# EAGLE design E-P-204-R3.2 (EAGLE 6.4)
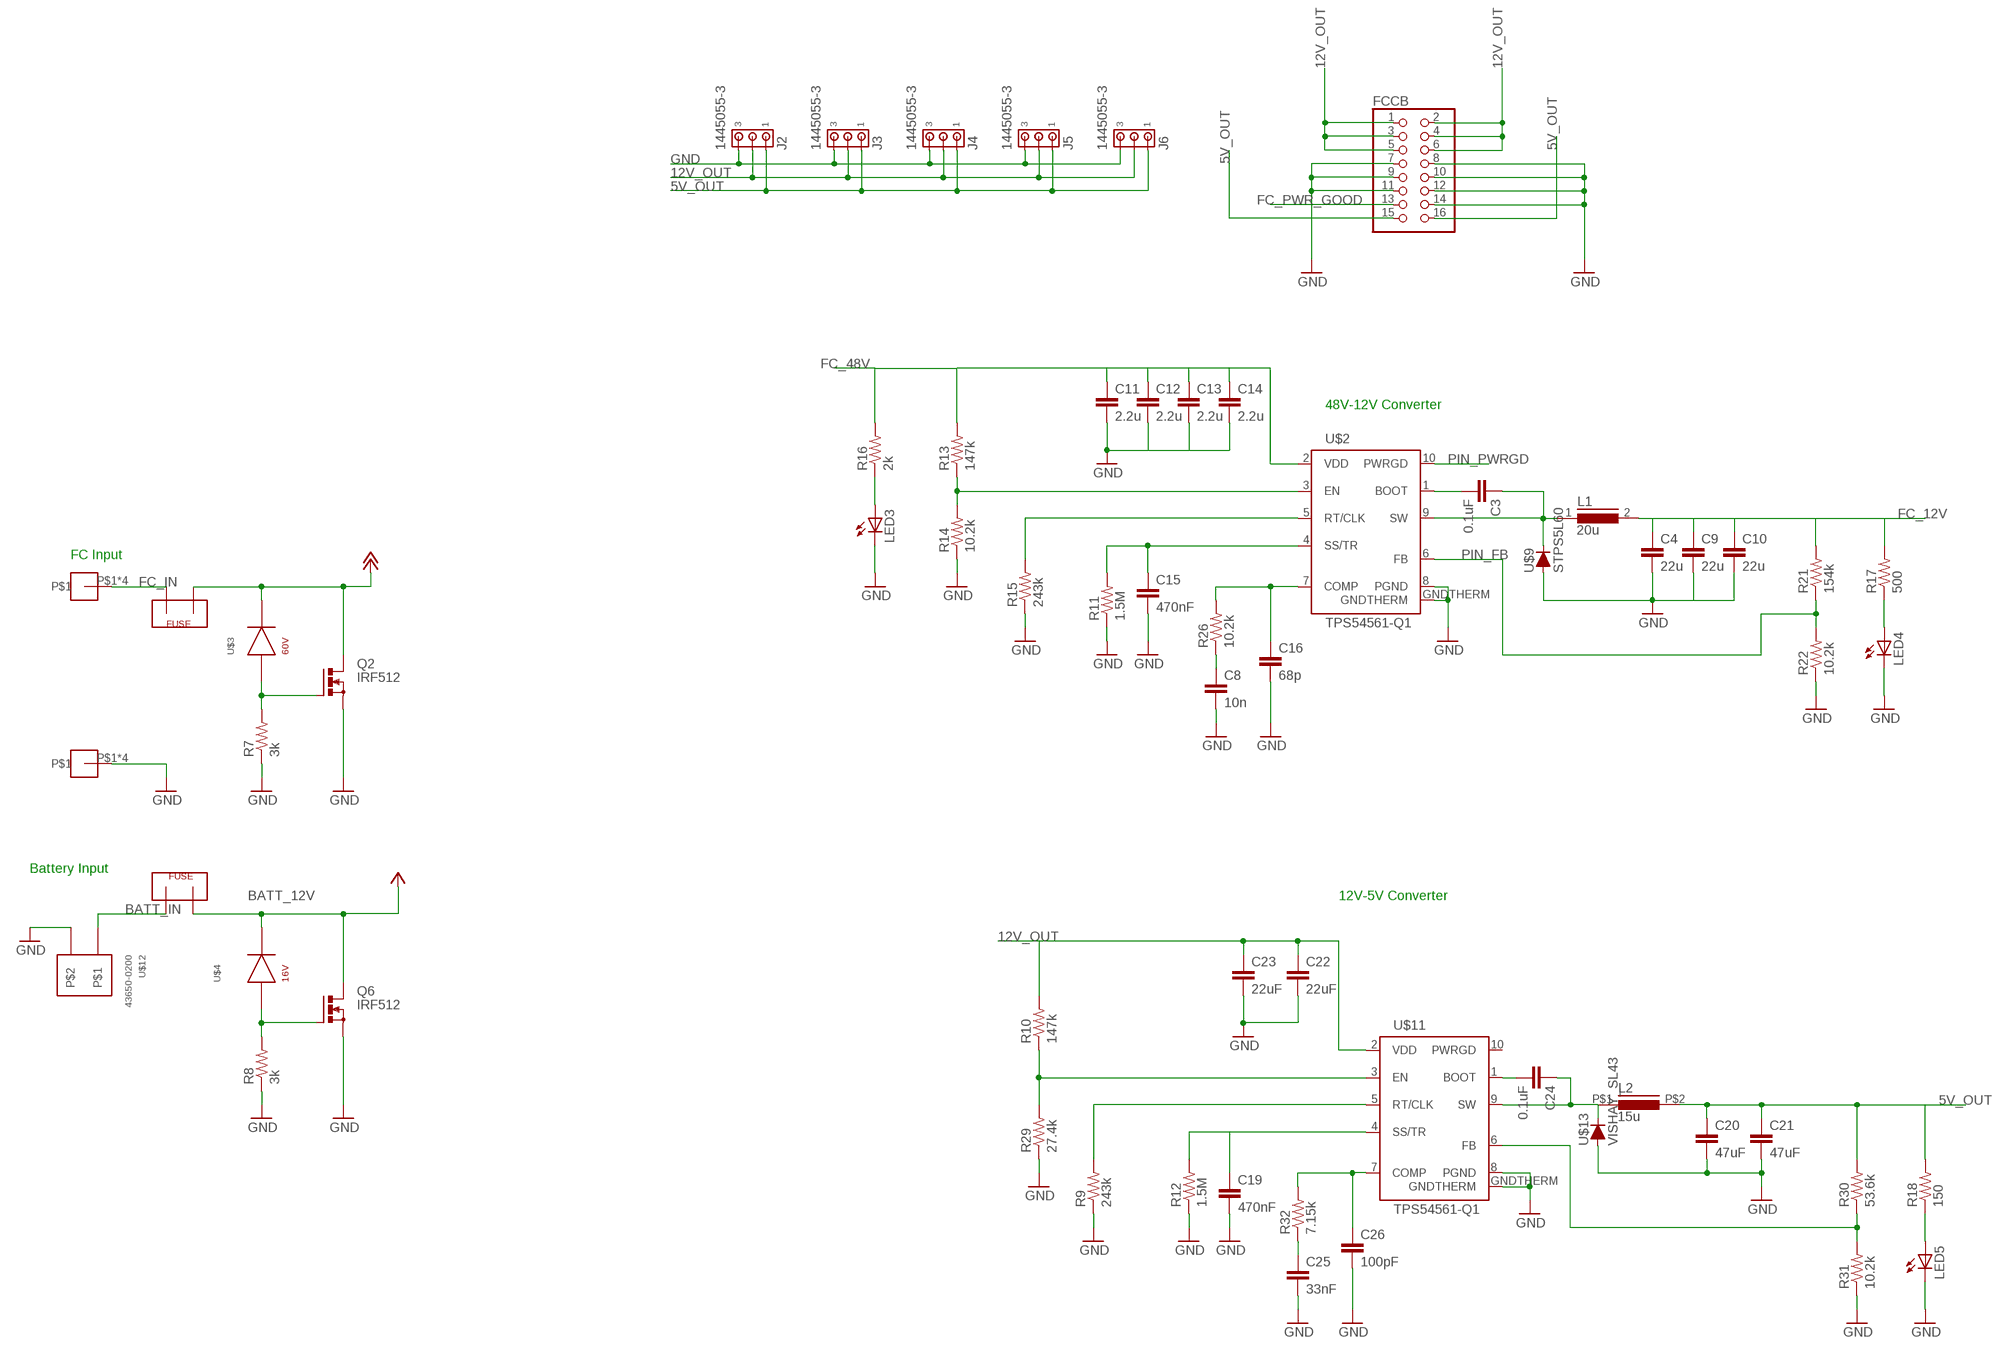
[diagram p0: schematic, sheet 1, part 1 of 2]
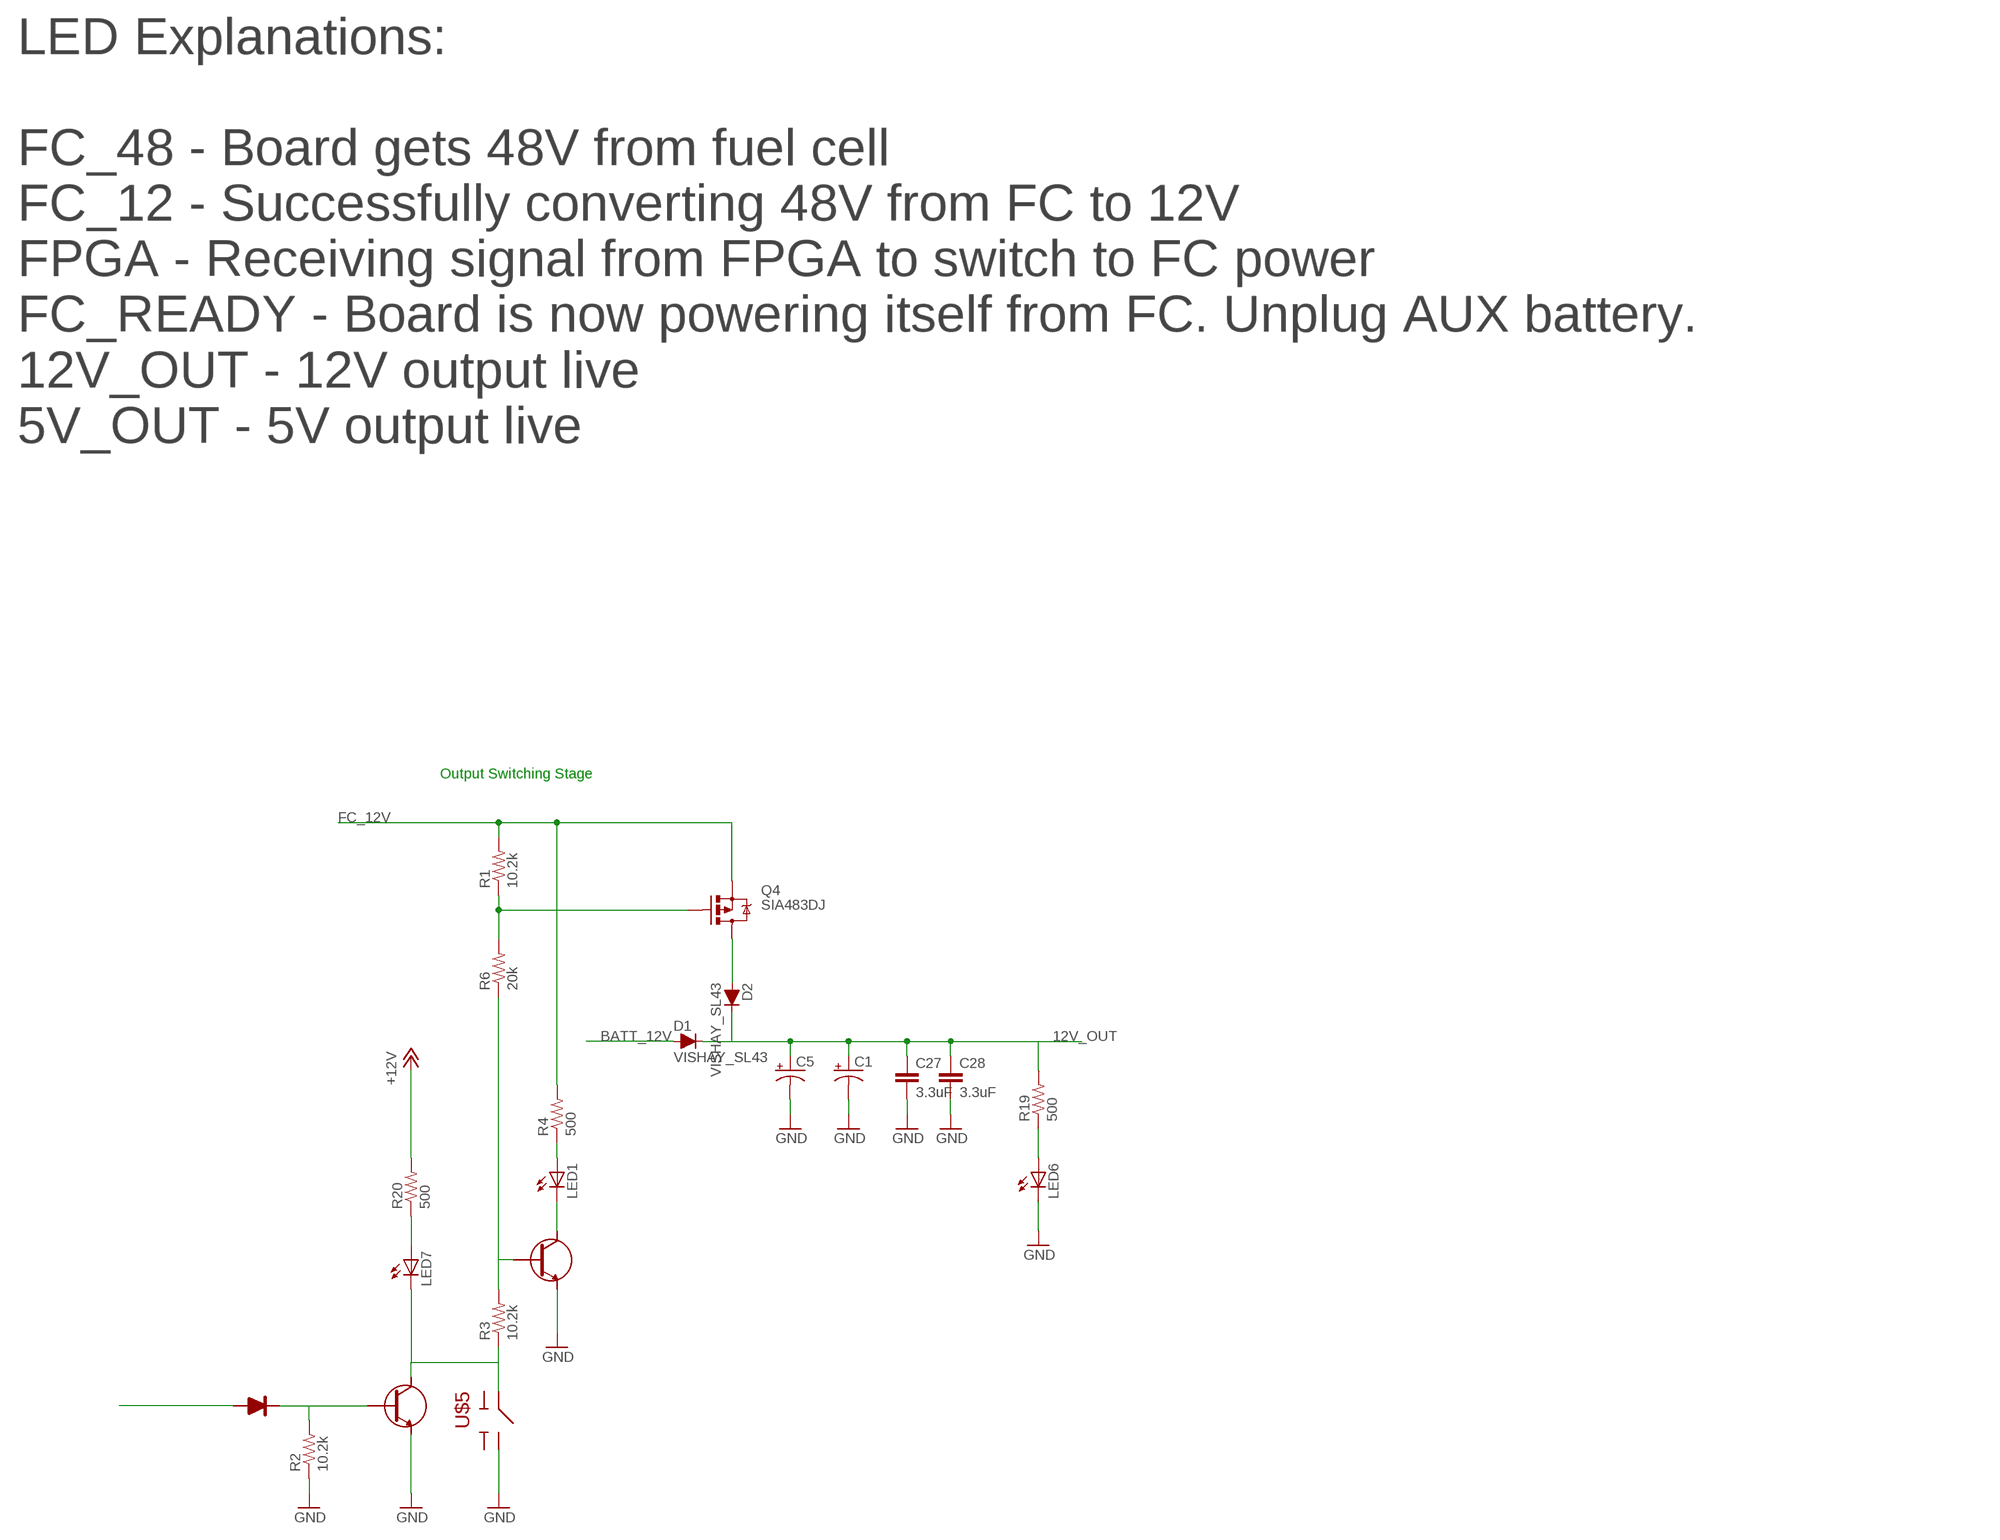
[diagram p1: schematic, sheet 1, part 2 of 2]

## Parts
C1  CAP_POLE  [PANASONIC_E]
C3  0.1uF  C-EUC0603K  [C0603K]
C4  22u  C-EUC0805K  [C0805K]
C5  CAP_POLE  [PANASONIC_E]
C8  10n  C-EUC0805K  [C0805K]
C9  22u  C-EUC0805K  [C0805K]
C10  22u  C-EUC0805K  [C0805K]
C11  2.2u  CAP1210  [1210]
C12  2.2u  CAP1210  [1210]
C13  2.2u  CAP1210  [1210]
C14  2.2u  CAP1210  [1210]
C15  470nF  C-EUC0805K  [C0805K]
C16  68p  C-EUC0805K  [C0805K]
C19  470nF  C-EUC0805K  [C0805K]
C20  47uF  C-EUC0805K  [C0805K]
C21  47uF  C-EUC0805K  [C0805K]
C22  22uF  C-EUC0805K  [C0805K]
C23  22uF  C-EUC0805K  [C0805K]
C24  0.1uF  C-EUC0603K  [C0603K]
C25  33nF  C-EUC0805K  [C0805K]
C26  100pF  C-EUC0805K  [C0805K]
C27  3.3uF  C-EUC0805K  [C0805K]
C28  3.3uF  C-EUC0805K  [C0805K]
D1  VISHAY_SL43  [DO-214AB_SMC]
D2  VISHAY_SL43  [DO-214AB_SMC]
FCCB  PINHD-2X8  [2X08]
J2  1445055-3  [1445055-3]
J3  1445055-3  [1445055-3]
J4  1445055-3  [1445055-3]
J5  1445055-3  [1445055-3]
J6  1445055-3  [1445055-3]
L1  20u  CTX20-5-52-R  [CTX-20-5-52R]
L2  15u  DR127-150-R  [DR127]
LED1  LED1206  [LED-1206]
LED3  LED1206  [LED-1206]
LED4  LED1206  [LED-1206]
LED5  LED1206  [LED-1206]
LED6  LED1206  [LED-1206]
LED7  LED1206  [LED-1206]
Q2  IRF512  [TO220BV]
Q4  SIA483DJ  [SC70-6L]
Q6  IRF512  [TO220BV]
R1  10.2k  R-US_M0805  [M0805]
R2  10.2k  R-US_M0805  [M0805]
R3  10.2k  R-US_M0805  [M0805]
R4  500  R-US_M0805  [M0805]
R6  20k  R-US_M0805  [M0805]
R7  3k  R-US_R1210  [R1210]
R8  3k  R-US_R1210  [R1210]
R9  243k  R-US_M0805  [M0805]
R10  147k  R-US_M0805  [M0805]
R11  1.5M  R-US_M0805  [M0805]
R12  1.5M  R-US_M0805  [M0805]
R13  147k  R-US_M0805  [M0805]
R14  10.2k  R-US_M0805  [M0805]
R15  243k  R-US_M0805  [M0805]
R16  2k  R-US_M0805  [M0805]
R17  500  R-US_M0805  [M0805]
R18  150  R-US_M0805  [M0805]
R19  500  R-US_M0805  [M0805]
R20  500  R-US_M0805  [M0805]
R21  154k  R-US_M0805  [M0805]
R22  10.2k  R-US_M0805  [M0805]
R26  10.2k  R-US_M0805  [M0805]
R29  27.4k  R-US_M0805  [M0805]
R30  53.6k  R-US_M0805  [M0805]
R31  10.2k  R-US_M0805  [M0805]
R32  7.15k  R-US_M0805  [M0805]
U$1  ZXTN19100CFF  [SOT23]
U$2  TPS54561-Q1  [PWSON10]
U$3  SMBJ60CA  [.277X.089]
U$4  SMAJ16CA  [.25X.07]
U$5  GT12MSCBE  [GT12MSCBE]
U$6  SCREW-8191  [SCREW-8191]
U$7  FUSEMINI-BLADE  [MINI-BLADE-FUSE]
U$8  SCREW-8191  [SCREW-8191]
U$9  STPS5L60  [STM_SMC]
U$10  FUSEMINI-BLADE  [MINI-BLADE-FUSE]
U$11  TPS54561-Q1  [PWSON10]
U$12  43650-0200  [43650-0200]
U$13  VISHAY_SL43  [DO-214AB_SMC]
U$14  ZXTN19100CFF  [SOT23]
U$15  CDSF4148  [CDSF4148]

## Nets
5V_OUT: C20.1 C21.1 FCCB.15 FCCB.16 J2.1 J3.1 J4.1 J5.1 J6.1 L2.P$2 R18.2 R30.2
12V_OUT: C1.+ C5.+ C22.1 C23.1 C27.1 C28.1 D1.C D2.C FCCB.1 FCCB.2 FCCB.3 FCCB.4 FCCB.5 FCCB.6 J2.2 J3.2 J4.2 J5.2 J6.2 R10.2 R19.2 R20.2 U$11.2(VDD) ; supply symbol labelled +12V
BATT_12V: D1.A Q6.D U$4.CATHODE U$10.IN ; supply symbol labelled +5V
BATT_IN: U$10.OUT U$12.P$2
FC_12V: C4.1 C9.1 C10.1 L1.2 Q4.S@0(S) Q4.S@1(S) R1.2 R4.2 R17.2 R21.2
FC_48V: C11.1 C12.1 C13.1 C14.1 Q2.D R13.2 R16.2 U$2.2(VDD) U$3.CATHODE U$7.OUT ; supply symbol labelled +12V
FC_IN: U$7.IN U$8.P$1 U$8.P$2 U$8.P$3 U$8.P$4
FC_PWR_GOOD: FCCB.13 U$15.ANODE(P$A)
GND: C1.- C4.2 C5.- C8.2 C9.2 C10.2 C11.2 C12.2 C13.2 C14.2 C15.2 C16.2 C19.2 C20.2 C21.2 C22.2 C23.2 C25.2 C26.2 C27.2 C28.2 FCCB.7 FCCB.8 FCCB.9 FCCB.10 FCCB.11 FCCB.12 FCCB.14 J2.3 J3.3 J4.3 J5.3 J6.3 LED3.C LED4.C LED5.C LED6.C Q2.S Q6.S R2.1 R7.1 R8.1 R9.1 R11.1 R12.1 R14.1 R15.1 R22.1 R29.1 R31.1 U$1.P$2E(P$E) U$2.8(PGND) U$2.GNDTHERM U$5.P$3 U$6.P$1 U$6.P$2 U$6.P$3 U$6.P$4 U$9.A U$11.8(PGND) U$11.GNDTHERM U$12.P$1 U$13.A U$14.P$2E(P$E)
N$1: C3.2 U$2.1(BOOT)
N$2: R9.2 U$11.5(RT/CLK)
N$3: LED7.C R3.1 U$5.P$1 U$14.P$3C(P$C)
N$4: R3.2 R6.1 U$1.P$1B(P$B)
N$5: C3.1 L1.1 U$2.9(SW) U$9.C
N$6: Q4.G R1.1 R6.2
N$7: Q2.G R7.2 U$3.ANODE
N$8: Q6.G R8.2 U$4.ANODE
N$9: D2.A Q4.D
N$10: R13.1 R14.2 U$2.3(EN)
N$12: LED1.C U$1.P$3C(P$C)
N$13: R10.1 R29.2 U$11.3(EN)
N$14: R15.2 U$2.5(RT/CLK)
N$15: LED1.A R4.1
N$16: R2.2 U$14.P$1B(P$B) U$15.CATHODE(P$C)
N$18: C16.1 R26.2 U$2.7(COMP)
N$20: LED3.A R16.1
N$21: LED4.A R17.1
N$22: LED5.A R18.1
N$23: C8.1 R26.1
N$24: LED6.A R19.1
N$27: C19.1 R12.2 U$11.4(SS/TR)
N$28: C24.2 U$11.1(BOOT)
N$29: LED7.A R20.1
N$30: C24.1 L2.P$1 U$11.9(SW) U$13.C
N$32: R30.1 R31.2 U$11.6(FB)
N$33: C26.1 R32.2 U$11.7(COMP)
N$34: C25.1 R32.1
PIN_FB: R21.1 R22.2 U$2.6(FB)
PIN_PWRGD: U$2.10(PWRGD)
PIN_SS: C15.1 R11.2 U$2.4(SS/TR)
Unconnected: U$5.P$4 U$5.P$6 U$11.10(PWRGD)

## Notes on the sheet
- 48V-12V Converter
- FC Input
- LED Explanations:
  
  FC_48 - Board gets 48V from fuel cell
  FC_12 - Successfully converting 48V from FC to 12V
  FPGA - Receiving signal from FPGA to switch to FC power
  FC_READY - Board is now powering itself from FC. Unplug AUX battery.
  12V_OUT - 12V output live
  5V_OUT - 5V output live
- Battery Input
- Output Switching Stage
- 12V-5V Converter

## Library data of the parts
C1 C5 = SparkFun-Capacitors:CAP_POL: Capacitor Polarized These are standard SMD and PTH capacitors. Normally 10uF, 47uF, and 100uF in electrolytic and tantalum varieties. Always verify the external diameter of the through hole cap, it varies with capacity, voltage, and manufacturer. The EIA devices should be standard.
C3 C4 C8-C10 C16 C20-C26 = rcl:C-EU: CAPACITOR, European symbol
C11-C14 = SparkFun:CAP: Capacitor Standard 0603 ceramic capacitor, and 0.1" leaded capacitor.
C15 C19 C27 C28 = resistor:C-EU: CAPACITOR, European symbol
D1 D2 U$13 = Power Board Components:VISHAY_SL43
FCCB = pinhead:PINHD-2X8: PIN HEADER
J2-J6 = con-amp:1445055-3: Micro MATE-N-LOK Connectors grid 1.5 mm Source: ENG_CD_1445055_A.pdf
L1 = Power Board Components:CTX20-5-52-R
L2 = Power Board Components:DR127-150-R
LED1 LED3-LED7 = SparkFun:LED: LEDs Standard schematic elements and footprints for 5mm, 3mm, 1206, and 0603 sized LEDs. 5mm - Spark Fun Electronics SKU : COM-00529 (and others)
Q2 Q6 = transistor-power:IRF512: N-CHANNEL MOS FET
Q4 = Power Board Components:SIA483DJ
R1-R4 R6 R9-R22 R26 R29-R32 = rcl:R-US_: RESISTOR, American symbol
R7 R8 = resistor:R-US_: RESISTOR, American symbol
U$1 U$14 = Power Board Components:ZXTN19100CFF
U$2 U$11 = Power Board Components:TPS54561-Q1
U$3 = Power Board Components:SMBJ60CA
U$4 = Power Board Components:SMAJ16CA
U$5 = Power Board Components:GT12MSCBE
U$6 U$8 = Shell2013:SCREW-8191
U$7 U$10 = Shell2013:FUSE
U$9 = Power Board Components:STPS5L60
U$12 = Shell2013:43650-0200
U$15 = Power Board Components:CDSF4148

## Board
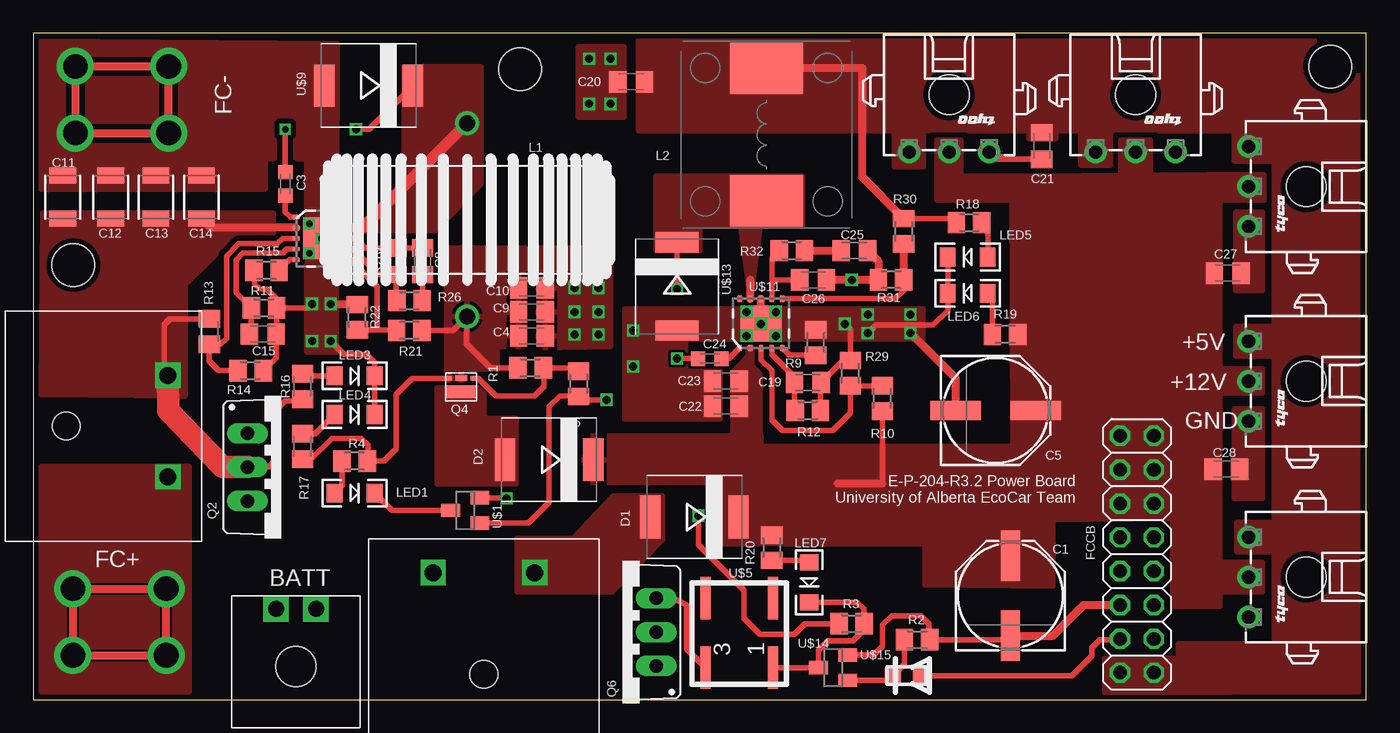
[diagram p2: board, top side]
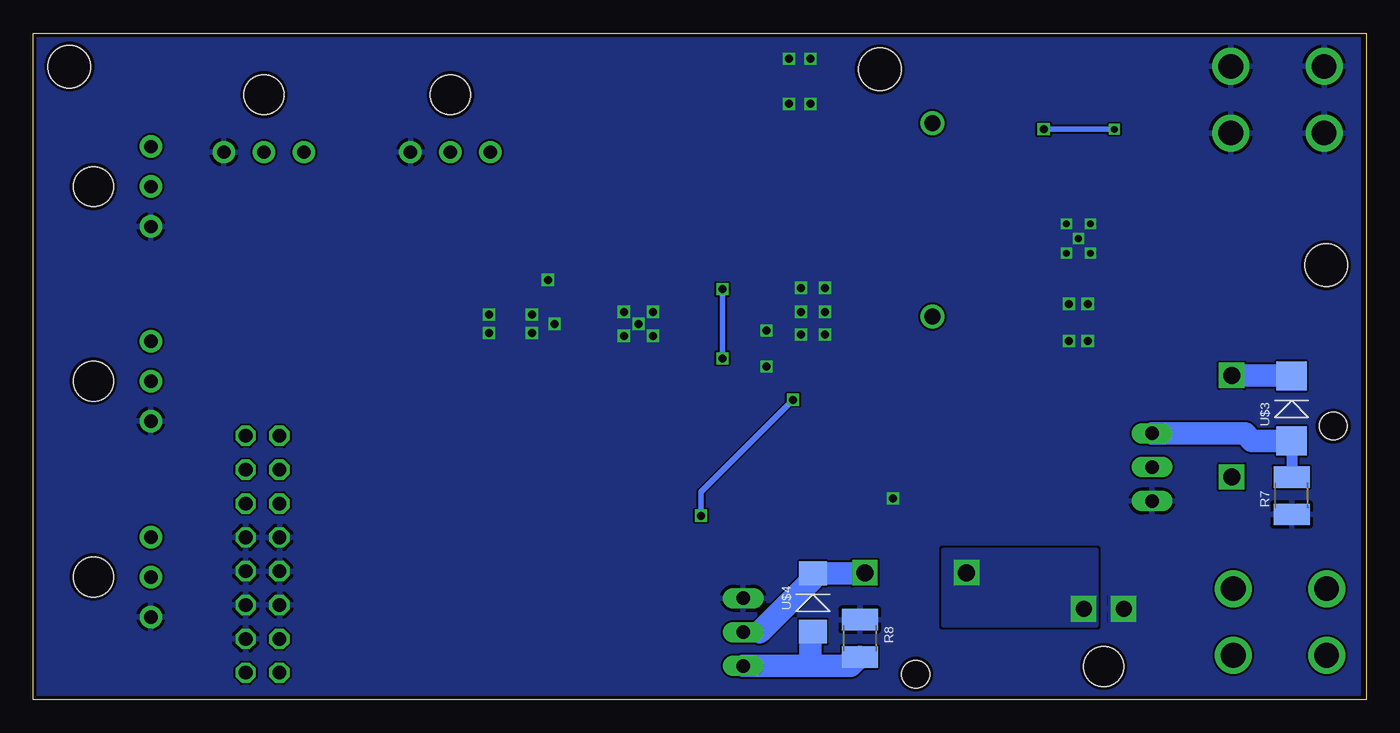
[diagram p3: board, bottom side, seen from below]

Size 100 x 50 mm. Coordinates in mm from the lower left corner, seen from the top.
Outline: 0,0 100,0 100,50 0,50 0,0
Copper layers (1*16): Top 0.035mm / dielectric 1.5mm / Bottom 0.035mm
Design rules "SeeedStudio_2layer_DRU_no_angle_20140221": minimum track width 6mil, minimum drill 12mil, track to track 6mil, track to pad 6mil, pad to pad 6mil, via to via 6mil, smd to smd 0mil, copper to edge 10mil, drill to drill 10mil, minimum pad ring 10mil, minimum via ring 6mil, stop-mask expansion 2mil, vias tented up to drill 100mil, thermal gap 10mil
Holes 3.2 mm at 97.3,47.5 3,32.6 36.5,47.3

### Footprints (pad centres in the part's own frame; a part is rotated, then mirrored left to right if it is on the bottom)
PANASONIC_E = smd 3.8 x 1.4: + 3,0; - -3,0
C0603K = smd 1.05 x 1.08: 1 -0.875,0; 2 0.875,0
C0805K = smd 1.3 x 1.6: 1 -1,0; 2 1,0
1210 = smd 1.2 x 2: 1 -1.6,0; 2 1.6,0
DO-214AB_SMC = smd 1.524 x 3.2: A 3.302,0; C -3.302,0
2X08 = drill 1.016 octagon: 1 -8.89,-1.27; 2 -8.89,1.27; 3 -6.35,-1.27; 4 -6.35,1.27; 5 -3.81,-1.27; 6 -3.81,1.27; 7 -1.27,-1.27; 8 -1.27,1.27; 9 1.27,-1.27; 10 1.27,1.27; 11 3.81,-1.27; 12 3.81,1.27; 13 6.35,-1.27; 14 6.35,1.27; 15 8.89,-1.27; 16 8.89,1.27
1445055-3 = drill 1 pad 1.676: 1 3,4.32; 2 0,4.32; 3 -3,4.32 | hole 3: 0,0
CTX-20-5-52R = drill 1.2: 1 -7.25,0; 2 7.25,0
DR127 = smd 3.85 x 5.5: P$1 -4.975,0; P$2 4.975,0
LED-1206 = smd 1.2 x 1.4: A -1.5,0; C 1.5,0
TO220BV = drill 1.016 long: D 0,-2.54; G -2.54,-2.54; S 2.54,-2.54
SC70-6L = smd 0.95 x 2.4: D 0,0 | smd 0.35 x 0.5: G 1.01,-0.95; S@0 1.01,0.95 | smd 0.45 x 0.87: S@1 1.05,0
M0805 = smd 1.3 x 1.6: 1 -0.95,0; 2 0.95,0
R1210 = smd 1.6 x 2.7: 1 -1.4,0; 2 1.4,0
SOT23 = smd 1 x 1.4: P$1B -0.95,-1.1; P$2E 0.95,-1.1; P$3C 0,1.1
PWSON10 = smd 0.35 x 0.5: 1 -1.6,-1.85; 2 -0.8,-1.85; 3 0,-1.85; 4 0.8,-1.85; 5 1.6,-1.85; 6 1.6,1.85; 7 0.8,1.85; 8 0,1.85; 9 -0.8,1.85; 10 -1.6,1.85 | smd 3.1 x 2.7: GNDTHERM 0,0
.277X.089 = smd 2.159 x 2.261: ANODE 0,0; CATHODE 4.877,0
.25X.07 = smd 1.778 x 2.083: ANODE 0,0; CATHODE 4.369,0
GT12MSCBE = smd 3.175 x 0.762: P$1 0,0; P$3 0,-5.08; P$4 -5.207,0; P$6 -5.207,-5.08
SCREW-8191 = drill 1.85: P$1 0,0; P$2 0,5; P$3 7,5; P$4 7,0
MINI-BLADE-FUSE = drill 1.27 square: IN 3.81,7.62; OUT -3.81,7.62 | hole 2.083: 0,0
STM_SMC = smd 1.54 x 3.14: A 3.325,0; C -3.325,0
43650-0200 = drill 1.2 pad 1.93 square: P$1 -1.5,0; P$2 1.5,0 | hole 3: 0,-4.32
CDSF4148 = smd 1.2 x 1.2: ANODE 0,0; CATHODE 2.1,0

### Placement (x,y rotation side)
C1  73.3,7.8 90 top
C3  18.9,38.7 270 top
C4  37.4,27.3 0 top
C5  72.2,21.7 0 top
C8  29.2,32.9 90 top
C9  37.4,29.1 0 top
C10  37.4,30.9 0 top
C11  2.21,37.7 90 top
C12  5.81,37.7 90 top
C13  9.21,37.7 90 top
C14  12.61,37.7 90 top
C15  17.22,27.43 0 top
C16  27.2,32.9 90 top
C19  58.1,23.8 0 top
C20  44.85,46.36 180 top
C21  75.66,41.55 270 top
C22  51.95,22.02 180 top
C23  51.95,23.9 180 top
C24  50.75,25.59 0 top
C25  61.6,33.7 0 top
C26  58.5,31.5 0 top
C27  89.6,32 0 top
C28  89.5,17.3 0 top
D1  49.6,13.7 180 top
D2  38.7,18 180 top
FCCB  82.8,10.9 270 top
J2  68.7,45.4 180 top
J3  82.7,45.4 180 top
J4  95.5,38.5 90 top
J5  95.5,23.9 90 top
J6  95.5,9.2 90 top
L1  32.55,36 270 top
L2  55,42.4 90 top
LED1  24.1,15.5 0 top
LED3  24.1,24.3 0 top
LED4  24.1,21.4 0 top
LED5  70.1,33.2 180 top
LED6  70.1,30.5 180 top
LED7  58.2,8.8 270 top
Q2  18.61,17.44 270 top
Q4  32.1,23.1 90 top
Q6  44.2,5.06 90 top
R1  37.3,24.9 180 top
R2  66.3,4.5 180 top
R3  61.4,5.7 180 top
R4  24.1,17.9 0 top
R6  40.9,23.7 90 top
R7  5.6,15.3 90 bottom
R8  38,4.6 270 bottom
R9  58.7,26.8 270 top
R10  63.7,22.6 270 top
R11  17.3,29.4 180 top
R12  58.1,21.7 180 top
R13  13.2,27.62 90 top
R14  16.3,24.68 180 top
R15  17.49,32.21 0 top
R16  20.2,23.5 270 top
R17  20.2,19 270 top
R18  70.2,35.8 180 top
R19  72.9,27.4 0 top
R20  55.4,11.4 90 top
R21  28.2,27.7 0 top
R22  24.3,28.7 270 top
R26  28.22,29.94 180 top
R29  61.3,24.5 270 top
R30  65.29,35.15 90 top
R31  64.35,31.5 0 top
R32  56.9,33.7 180 top
U$1  32.4,14.2 90 top
U$2  21.59,34.61 270 top
U$3  5.6,19.4 90 bottom
U$4  41.5,5.1 90 bottom
U$5  55.5,2.4 270 top
U$6  10.16,47.52 180 top
U$7  2.47,20.52 270 top
U$8  9.97,8.32 180 top
U$9  25.15,46.08 180 top
U$10  33.8,1.9 0 top
U$11  54.59,28.23 0 top
U$12  19.7,6.8 0 top
U$13  48.3,31 270 top
U$14  60,2.4 90 top
U$15  66.6,1.8 180 top

### Tracks (layer width: path | path; a pad name or v marks a point on that pad's centre or on a via)
5V_OUT
  Top 0.406: R18.2 68.95,36.1 R30.2
  Top 0.61: R30.2 62.2,39.19 62.2,47.4 62.17,47.38 L2.P$2
  pour Top (isolate 0.406, rank 2, no thermals): 45.4,49.6 99.6,49.6 99.7,0.4 93.1,0.4 93.1,42.7 45.4,42.7
  pour Top (isolate 0.61, rank 2, no thermals): 64.6,43.3 64.6,40 66.8,40 66.8,43.3
  pour Top (isolate 0.406, rank 2, no thermals): 78.6,43.9 78.6,40.1 80.8,40.1 80.8,43.9
  pour Top (isolate 0.406, rank 2, no thermals): 90.3,11.1 95,11.1 95,13.3 90.3,13.3
  pour Top (isolate 0.406, rank 2, no thermals): 90.2,25.8 94.6,25.8 94.6,28 90.2,28
  pour Top (isolate 0.406, rank 2, no thermals): 90.1,40.4 93.4,40.4 93.4,43.3 90.1,43.3
  pour Top (no thermals): 74.7,44.3 76.7,44.3 76.7,42.1 74.7,42.1
  pour Top (no thermals): 80.4,3.1 85.9,3.1 85.9,4.2 99.4,4.2 99.4,0.6 80.4,0.5
12V_OUT
  Top 0.406: R10.2 63.7,16.2
  Top 0.61: 63.7,16.2 60.35,16.2
  pour Top (no thermals): 54.5,24.4 53.9,25 53.9,26.4 53.6,26.4 53.6,25.8 52.5,24.6 52.5,18.1 54.5,18.1
  pour Top (isolate 0.406, no thermals): 51.9,19 73.5,19 73.4,39.3 89,39.4 89,7 85.5,7 85.5,13.6 76.5,13.5 76.5,8.5 66.9,8.6 66.9,11.7 51.9,11.7
  pour Top (isolate 0.406, no thermals): 81.6,38.5 81.6,42 83.8,42 83.8,38.5
  pour Top (isolate 0.406, no thermals): 92.3,37.5 88.1,37.5 88.1,39.4 92.3,39.4
  pour Top (isolate 0.406, no thermals): 92.2,23 87.4,23 87.4,24.8 92.2,24.8
  pour Top (isolate 0.406, no thermals): 92.2,8.1 86.8,8.1 86.8,10.3 92.2,10.3
  pour Top: 41.3,19.8 54.6,19.8 54.6,16.3 41.3,16.3
  pour Top (no thermals): 67.8,42 69.6,42 69.6,39.3 77.2,39.3 77.2,37.5 67.8,37.5
BATT_12V
  Bottom 1.016: Q6.D 45.51,5.06
  Bottom 1.676: 45.51,5.06 41.5,9.07 U$4.CATHODE 37.66,9.47 U$10.IN
  pour Top (no thermals): 43.4,8.1 36.3,8.1 36.3,12.1 40.5,12.1 43.5,15.3 47.2,15.3 47.2,12
BATT_IN
  pour Bottom (isolate 0.61, no thermals): 31.7,11.2 20.3,11.2 20.3,5.6 31.7,5.6
FC_12V
  Top 0.406: R17.2 20.85,18.05 22.4,19.6 24.6,19.6 25.1,19.1 25.1,17.95 | Q4.S@0 28.41,24.11 27.2,22.9 27.2,18.8 26.3,17.9 R4.2 | R21.2 31.5,27.7 L1.2 32.5,28.7 32.5,26.7 34.3,24.9 R1.2
  Top 0.61: 25.1,17.95 R4.2
  pour Top: 31,33.9 36.9,33.9 36.8,26.5 31,26.5
  pour Top: 31,27.5 34.8,27.5 34.8,24.8 32.4,24.8 32.4,24 31,24
FC_48V
  Top 0.406: 10.17,28.57 9.8,28.2 9.8,28.1 | 9.8,28.1 9.8,24.62 U$7.OUT | R13.2 10.27,28.57 9.8,28.1 | Q2.D 17.64,17.44 18.3,18.1 18.3,21.8 18.9,22.4 20.05,22.4
  Top 0.61: U$2.2 13.3,35.41 C14.1 | 20.05,22.4 R16.2
  Top 1.676: Q2.D 14.2,17.44 10.1,21.7 U$7.OUT
  Bottom 0.813: U$3.CATHODE 5.65,24.33
  Bottom 1.676: 5.65,24.33 U$7.OUT
  pour Top (isolate 0.4, no thermals): 11,22.8 0.6,22.9 0.7,36.5 18,36.5 18,35 15.3,35 11.4,31.2 11.4,22.8
FC_IN
  pour Top (no thermals): 11.7,17.5 0.6,17.5 0.6,0.6 11.7,0.6
FC_PWR_GOOD
  Top 0.406: U$15.ANODE 77.9,1.8 79.4,3.3 79.4,3.9 80,4.5 81.48,4.5
  Top 0.61: 81.48,4.5 FCCB.13
GND  (via drill 0.5, 0.6)
  Top 0.406: C19.2 58.85,23.9 | C19.2 60.75,25.45 R29.1 61.3,27.8 v60.9,28.2 | LED4.C LED3.C 25.6,25.3 25,25.9 23.3,25.9 v22.3,26.9 | R11.1 18.25,27.46 C15.2 18.22,25.65 R14.1 | R11.1 18.25,30.05 17.5,30.8 17,30.8 16.6,31.2 16.6,32.15 R15.1 | R11.1 20.6,29.4 v20.9,29.7 | C8.2 C16.2 24.9,33.9 24.19,34.61 U$2.8 | U$1.P$2E 35.45,15.15 v35.5,15.1 | LED5.C LED6.C 68.6,29.2 67.5,28.1 63.2,28.1 v62.6,27.5 | Q6.S 48,7.6 49,7.1 49,3.82 U$5.P$3 | U$14.P$2E 63.05,3.35 63.7,4 63.7,5.6 64.4,6.3 66.6,6.3 67.2,5.7 67.2,4.55 | C21.2 72.23,40.55 J2.3 | R12.1 59.05,23.75 C19.2 | R2.1 73,4.5
  Top 0.61: U$11.GNDTHERM U$11.8 | C26.2 v61.4,31.5 R31.1 63.4,32.9 C25.2 | R22.1 22.35,29.65 v22.3,29.7 | U$2.8 U$2.GNDTHERM | 67.2,4.55 R2.1 | C5.- 69.2,24.1 v65.8,27.5 | 73,4.5 C1.- 76.5,4.8 78.8,7.1 FCCB.11
  other vias: 20.7,35.7 22.5,35.7 20.7,33.5 22.5,33.5 45,27.7 45,25 53.5,29.1 53.5,27.3 54.6,28.2 55.7,29.1 55.7,27.3 62.6,28.9 40.6,30.9 42.4,30.9 40.6,29.1 42.4,29.1 40.6,27.4 42.4,27.4 20.9,26.9 41.7,44.7 43.3,44.7 43.3,48.1 41.7,48.1 65.8,28.9 21.6,34.6
  pour Top (isolate 0.203, no thermals): 66.8,27 66.8,29.4 44.3,29.4 44.3,21 51.6,21 51.6,24.7 49,24.7 49,27
  pour Top (isolate 0.4, no thermals): 22.7,26.1 22.8,49.2 0.6,49.4 0.6,38.3 17.4,38.3 17.4,40.6 20.5,40.6 20.5,26.1
  pour Bottom (rank 2): 99.6,0.4 99.6,49.6 0.6,49.6 0.6,0.4
  pour Top (isolate 0.406, no thermals): 92.2,21.8 90.1,21.8 90.1,15.1 92.2,15.1
  pour Top (isolate 0.406, rank 2, no thermals): 92.2,36.6 90.2,36.6 90.2,30.7 92.2,30.7
  pour Bottom (rank 2, no thermals): 19.2,8 16.5,8.1 16.5,5.6 19.2,5.5
  pour Top: 37.9,33.9 43.3,33.9 43.3,26.5 37.9,26.4
  pour Top (no thermals): 40.9,49 44.3,49 44.3,43.7 40.9,43.7
N$1
  Top 0.406: U$2.1 19.29,36.21 18.9,36.6 C3.2
N$2
  Top 0.406: U$11.5 56.72,25.85 R9.2
N$3
  Top 0.406: R3.1 62.25,5.15 61.5,4.4 59.6,4.4 58.9,3.7 U$14.P$3C U$5.P$1 | LED7.C 61.8,7.3 62.3,6.8 62.3,5.75
  Top 0.61: 62.3,5.75 R3.1
N$4  (via drill 0.6)
  Top 0.406: R3.2 57.9,5.7 57.1,4.9 54.5,4.9 53.3,6.1 53.3,8.2 49.9,11.6 v49.9,13.8 | v43,22.5 41.15,22.5 R6.1 40.85,22.8 39.5,22.8 38.7,22 38.7,14.8 37.15,13.25 U$1.P$1B
  Bottom 0.406: v49.9,13.8 49.9,15.6 v43,22.5
N$5  (via drill 0.5, 0.6)
  Top 0.406: C3.1 v18.9,42.8 | U$9.C 25.2,42.8 v24.2,42.8
  Top 0.61: U$2.9 24.71,35.41
  Top 0.813: 24.71,35.41 L1.1
  Bottom 0.406: v24.2,42.8 v18.9,42.8
  pour Top (no thermals): 27.8,47.5 33.6,47.5 33.6,42.3 27.8,42.3
  pour Top (no thermals): 27.8,42.3 27.8,38.8 24.7,35.7 24.7,35.2 30.1,35.2 33.6,38.7 33.6,42.3
N$6
  Top 0.406: Q4.G 33.39,24.11 34.7,22.8 37.6,22.8 38.3,23.5 38.3,24.85 R1.1 40.65,24.9 R6.2
N$7
  Bottom 0.813: U$3.ANODE R7.2
  Bottom 1.676: Q2.G 9.08,19.98 8.6,19.4 U$3.ANODE
N$8
  Bottom 1.676: R8.2 38.68,2.52 41.7,2.52 | 41.7,2.52 Q6.G | U$4.ANODE 41.7,4.9 41.7,2.52
N$9
  pour Top (no thermals): 30.3,23.4 33.8,23.4 33.8,21.1 36.2,21.1 36.2,16.2 30.3,16.2
N$10
  Top 0.406: U$2.3 18.71,34.61 18.3,34.2 15.4,34.2 14.5,33.3 14.5,27.1 14.07,26.67 R13.1 13.2,25.4 13.92,24.68 R14.2
N$12
  Top 0.406: U$1.P$3C 26.9,14.2 LED1.C
N$13
  Top 0.406: U$11.3 54.6,25.5 55.4,24.7 55.4,21 56.2,20.2 60,20.2 61.3,21.5 R29.2 R10.1
N$14
  Top 0.406: U$2.5 19.24,33.01 R15.2
N$15
  Top 0.406: R4.1 23.15,16.05 LED1.A
N$16
  Top 0.406: U$14.P$1B 64.15,1.45 U$15.CATHODE 65.35,2.65 R2.2
N$18
  Top 0.406: 27.2,30.01 C16.1 25.9,31.9 23.99,33.81 U$2.7
  Top 0.61: 27.2,30.01 R26.2
N$20
  Top 0.406: LED3.A 20.35,24.3
  Top 0.61: 20.35,24.3 R16.1
N$21
  Top 0.406: R17.1 21.15,19.95 LED4.A
N$22
  Top 0.406: R18.1 71.6,35.35 LED5.A
N$23
  Top 0.406: C8.1 29.2,29.97
  Top 0.61: 29.2,29.97 R26.1
N$24
  Top 0.406: LED6.A 71.95,30.15 R19.1
N$27
  Top 0.406: U$11.4 55.4,25.9 57.1,24.2 C19.1 57.1,21.75 R12.2
N$28
  Top 0.406: U$11.1 52.2,25.59 C24.2
N$29
  Top 0.406: R20.1 58.05,10.45
  Top 0.61: 58.05,10.45 LED7.A
N$30  (via drill 0.6)
  Top 0.406: C24.1 48.91,25.59 v48.3,25.6 | U$13.C v48.3,30.8
  Top 0.61: U$11.9 53.79,31.49 53.8,30.8
  Top 0.813: 53.8,36.23 L2.P$1
  Bottom 0.406: v48.3,25.6 v48.3,30.8
  pour Top (no thermals): 46.7,39.3 57.7,39.3 57.7,35.6 50,35.6 50,33.7 46.7,33.7
  pour Top (no thermals): 53,36 53.8,30.1 54.6,36 53.7,36.6
N$32
  Top 0.406: U$11.6 64.68,30.08 65.3,30.7 R31.2
  Top 0.61: R31.2 R30.1
N$33
  Top 0.406: 55.4,31.5 55.4,33.15 R32.2 | C26.1 55.4,31.5 | 55.4,31.5 U$11.7
N$34
  Top 0.61: R32.1 C25.1
PIN_FB
  Top 0.406: R22.2 25.8,27.75 | 25.8,27.75 27.4,27.75 | U$2.6 23.79,33.01 25.8,31 25.8,27.75
  Top 0.61: 27.4,27.75 R21.1
PIN_SS
  Top 0.406: U$2.4 19.01,33.81 18.7,33.5 15.7,33.5 15.2,33 15.2,30.55 R11.2 16.35,27.56 C15.1

### Text on the board
tPlace: FC- | +5V | +12V | GND | E-P-204-R3.2 Power Board / University of Alberta EcoCar Team | FC+ | BATT
tDocu: 5V_OUT | 12V_OUT | FC_48 | FC_12 | FC_READY | FC<- ->AUX | FPGA